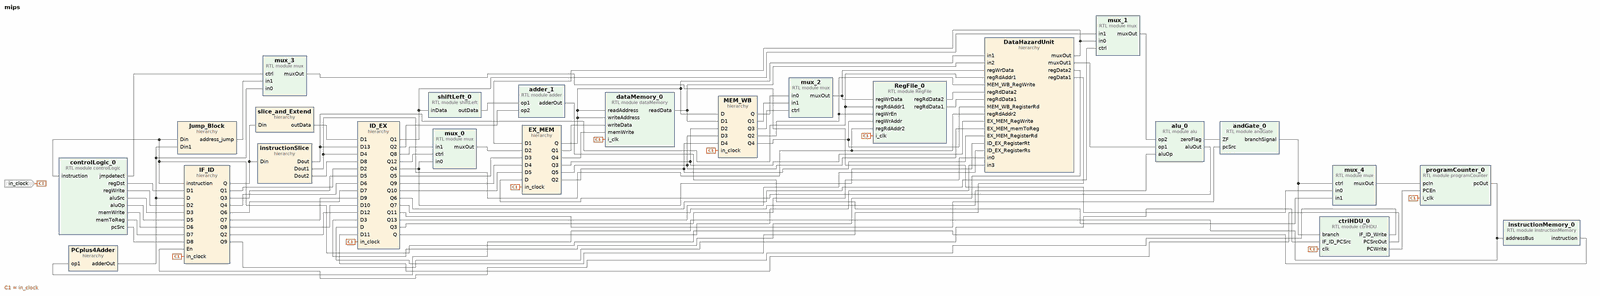
[diagram p0: block diagram of the top level, whole]
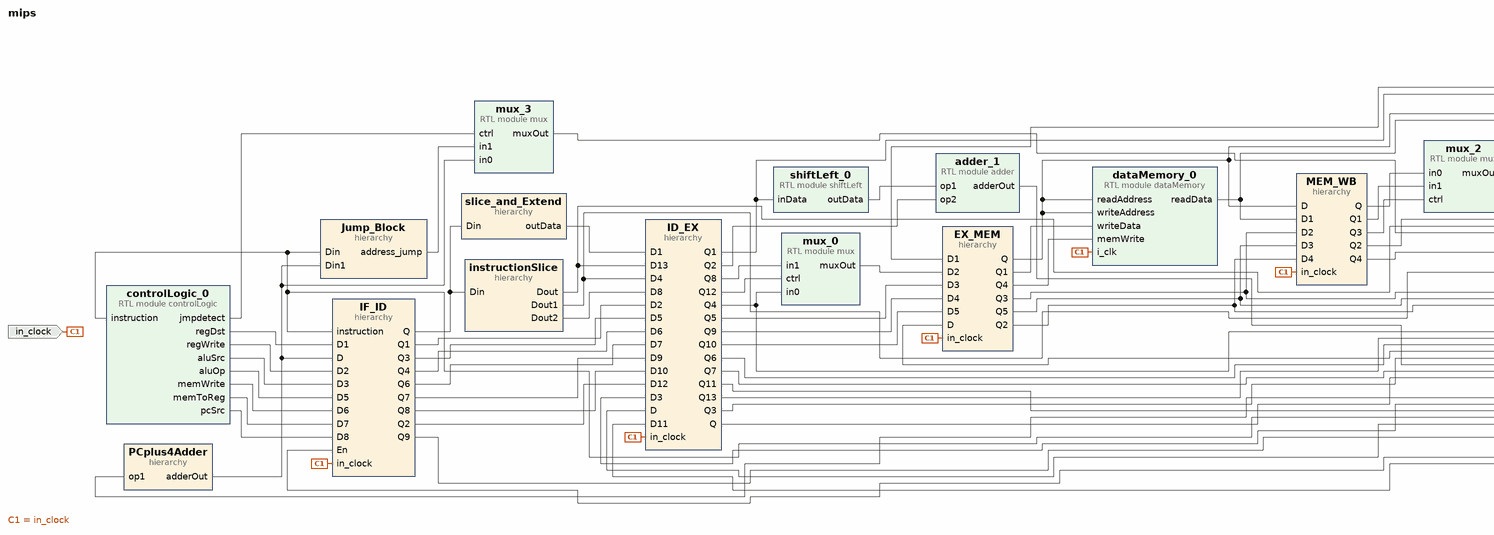
[diagram p1: block diagram of the top level, left part]
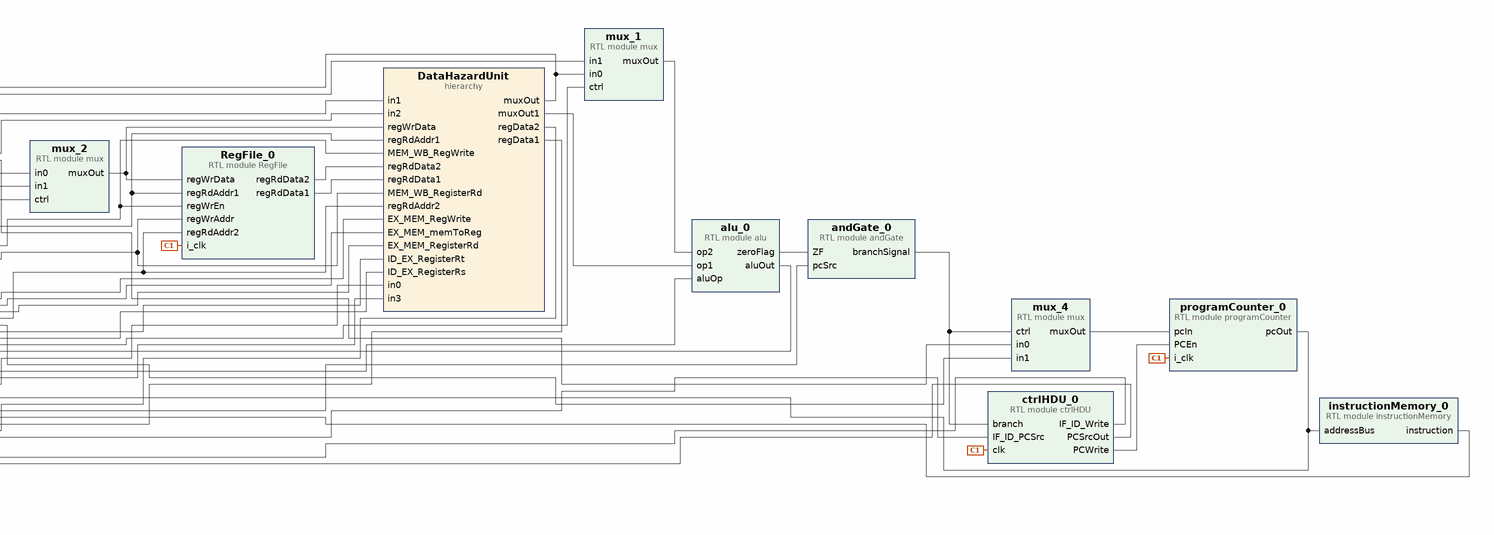
[diagram p2: block diagram of the top level, right part]
# Vivado block design mips, xc7z020clg400-1, Vivado 2020.2
create_bd_design mips

create_bd_port -dir I -type clk in_clock

create_bd_cell -type module -reference mux mux_1
set_property -dict {CONFIG.width 32} [get_bd_cells mux_1]
create_bd_cell -type module -reference mux mux_2
set_property -dict {CONFIG.width 32} [get_bd_cells mux_2]
create_bd_cell -type module -reference shiftLeft shiftLeft_0
create_bd_cell -type module -reference mux mux_3
set_property -dict {CONFIG.width 32} [get_bd_cells mux_3]
create_bd_cell -type module -reference RegFile RegFile_0
create_bd_cell -type module -reference alu alu_0
create_bd_cell -type module -reference mux mux_4
set_property -dict {CONFIG.width 32} [get_bd_cells mux_4]
create_bd_cell -type module -reference mux mux_0
set_property -dict {CONFIG.width 5} [get_bd_cells mux_0]
create_bd_cell -type hier IF_ID
create_bd_cell -type module -reference adder adder_1
set_property -dict {CONFIG.width 32} [get_bd_cells adder_1]
create_bd_cell -type hier ID_EX
create_bd_cell -type hier EX_MEM
create_bd_cell -type hier Jump_Block
create_bd_cell -type hier MEM_WB
create_bd_cell -type hier slice_and_Extend
create_bd_cell -type hier instructionSlice
create_bd_cell -type hier PCplus4Adder
create_bd_cell -type module -reference andGate andGate_0
create_bd_cell -type module -reference programCounter programCounter_0
create_bd_cell -type module -reference dataMemory dataMemory_0
create_bd_cell -type module -reference controlLogic controlLogic_0
create_bd_cell -type hier DataHazardUnit
create_bd_cell -type module -reference ctrlHDU ctrlHDU_0
create_bd_cell -type module -reference instructionMemory instructionMemory_0

# ---- hierarchy /IF_ID ----
current_bd_instance /IF_ID
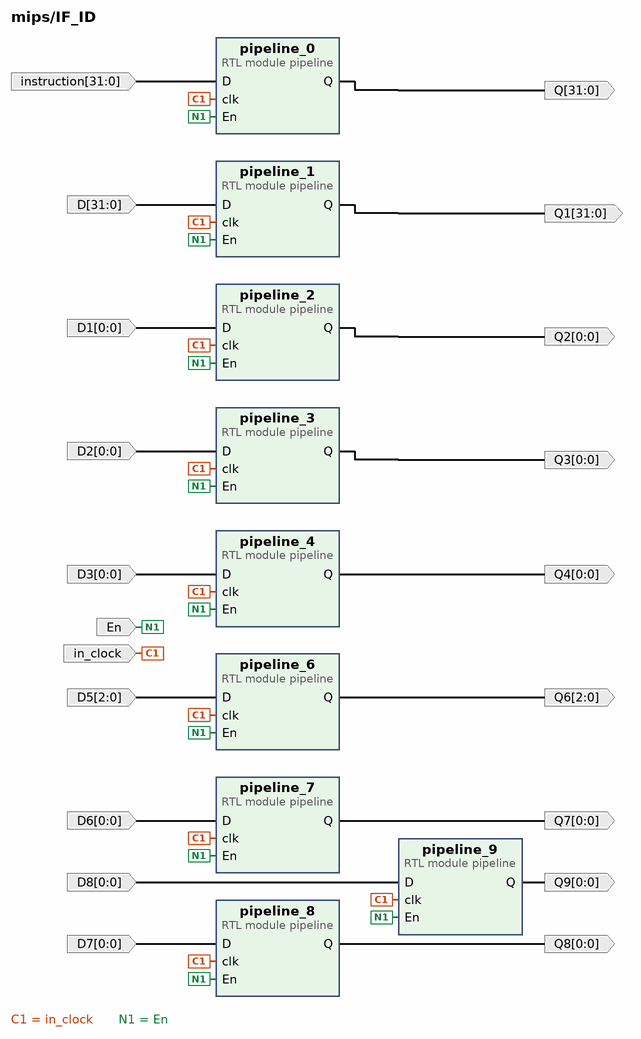
[diagram p3: block diagram inside /IF_ID]
create_bd_pin -dir I -type clk in_clock
create_bd_pin -dir I -from 31 -to 0 instruction
create_bd_pin -dir O -from 31 -to 0 Q
create_bd_pin -dir I -from 31 -to 0 D
create_bd_pin -dir O -from 31 -to 0 Q1
create_bd_pin -dir O -from 0 -to 0 Q2
create_bd_pin -dir I -from 0 -to 0 D1
create_bd_pin -dir O -from 0 -to 0 Q3
create_bd_pin -dir I -from 0 -to 0 D2
create_bd_pin -dir O -from 0 -to 0 Q4
create_bd_pin -dir I -from 0 -to 0 D3
create_bd_pin -dir O -from 2 -to 0 Q6
create_bd_pin -dir I -from 2 -to 0 D5
create_bd_pin -dir I -from 0 -to 0 D6
create_bd_pin -dir O -from 0 -to 0 Q7
create_bd_pin -dir I -from 0 -to 0 D7
create_bd_pin -dir O -from 0 -to 0 Q8
create_bd_pin -dir O -from 0 -to 0 Q9
create_bd_pin -dir I -from 0 -to 0 D8
create_bd_pin -dir I En

create_bd_cell -type module -reference pipeline pipeline_0
create_bd_cell -type module -reference pipeline pipeline_1
create_bd_cell -type module -reference pipeline pipeline_2
set_property -dict {CONFIG.width 1} [get_bd_cells pipeline_2]
create_bd_cell -type module -reference pipeline pipeline_3
set_property -dict {CONFIG.width 1} [get_bd_cells pipeline_3]
create_bd_cell -type module -reference pipeline pipeline_4
set_property -dict {CONFIG.width 1} [get_bd_cells pipeline_4]
create_bd_cell -type module -reference pipeline pipeline_6
set_property -dict {CONFIG.width 3} [get_bd_cells pipeline_6]
create_bd_cell -type module -reference pipeline pipeline_7
set_property -dict {CONFIG.width 1} [get_bd_cells pipeline_7]
create_bd_cell -type module -reference pipeline pipeline_8
set_property -dict {CONFIG.width 1} [get_bd_cells pipeline_8]
create_bd_cell -type module -reference pipeline pipeline_9
set_property -dict {CONFIG.width 1} [get_bd_cells pipeline_9]

# ---- hierarchy /ID_EX ----
current_bd_instance /ID_EX
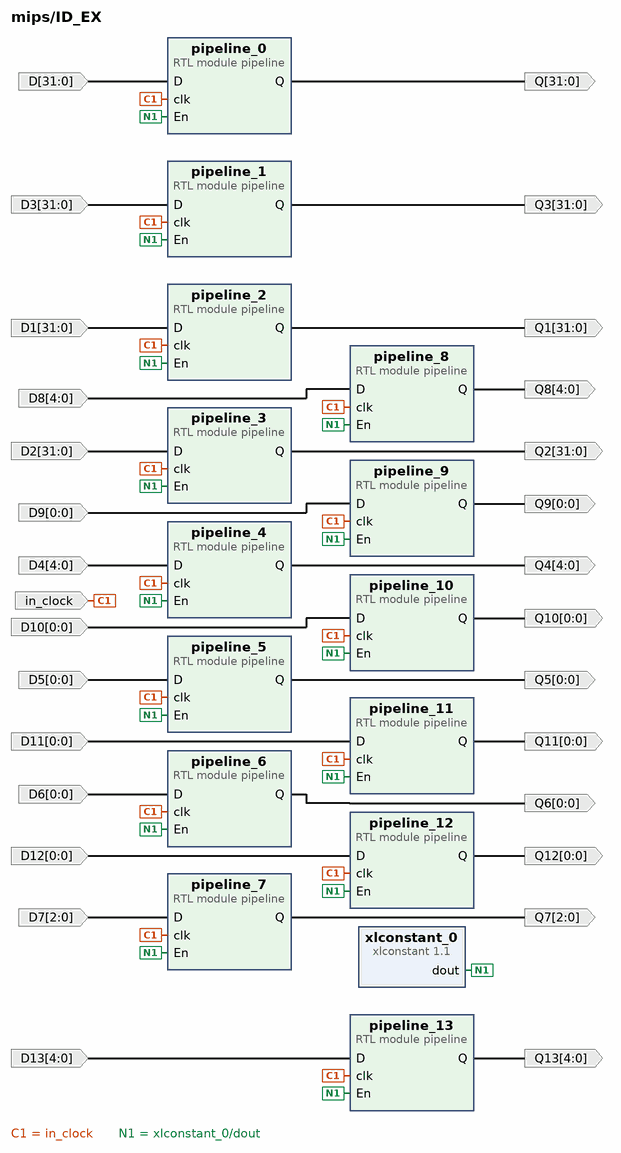
[diagram p4: block diagram inside /ID_EX]
create_bd_pin -dir I -type clk in_clock
create_bd_pin -dir I -from 31 -to 0 D
create_bd_pin -dir O -from 31 -to 0 Q
create_bd_pin -dir I -from 31 -to 0 D1
create_bd_pin -dir O -from 31 -to 0 Q1
create_bd_pin -dir I -from 31 -to 0 D2
create_bd_pin -dir O -from 31 -to 0 Q2
create_bd_pin -dir I -from 31 -to 0 D3
create_bd_pin -dir O -from 31 -to 0 Q3
create_bd_pin -dir I -from 0 -to 0 D5
create_bd_pin -dir O -from 0 -to 0 Q5
create_bd_pin -dir I -from 0 -to 0 D6
create_bd_pin -dir O -from 0 -to 0 Q6
create_bd_pin -dir I -from 2 -to 0 D7
create_bd_pin -dir O -from 2 -to 0 Q7
create_bd_pin -dir I -from 0 -to 0 D9
create_bd_pin -dir O -from 0 -to 0 Q9
create_bd_pin -dir I -from 0 -to 0 D10
create_bd_pin -dir O -from 0 -to 0 Q10
create_bd_pin -dir O -from 0 -to 0 Q11
create_bd_pin -dir I -from 0 -to 0 D11
create_bd_pin -dir I -from 4 -to 0 D4
create_bd_pin -dir I -from 4 -to 0 D8
create_bd_pin -dir I -from 0 -to 0 D12
create_bd_pin -dir O -from 4 -to 0 Q4
create_bd_pin -dir O -from 4 -to 0 Q8
create_bd_pin -dir O -from 0 -to 0 Q12
create_bd_pin -dir I -from 4 -to 0 D13
create_bd_pin -dir O -from 4 -to 0 Q13

create_bd_cell -type module -reference pipeline pipeline_0
create_bd_cell -type module -reference pipeline pipeline_10
set_property -dict {CONFIG.width 1} [get_bd_cells pipeline_10]
create_bd_cell -type module -reference pipeline pipeline_11
set_property -dict {CONFIG.width 1} [get_bd_cells pipeline_11]
create_bd_cell -type module -reference pipeline pipeline_12
set_property -dict {CONFIG.width 1} [get_bd_cells pipeline_12]
create_bd_cell -type module -reference pipeline pipeline_13
set_property -dict {CONFIG.width 5} [get_bd_cells pipeline_13]
create_bd_cell -type module -reference pipeline pipeline_1
create_bd_cell -type module -reference pipeline pipeline_2
create_bd_cell -type module -reference pipeline pipeline_3
create_bd_cell -type module -reference pipeline pipeline_4
set_property -dict {CONFIG.width 5} [get_bd_cells pipeline_4]
create_bd_cell -type module -reference pipeline pipeline_5
set_property -dict {CONFIG.width 1} [get_bd_cells pipeline_5]
create_bd_cell -type module -reference pipeline pipeline_6
set_property -dict {CONFIG.width 1} [get_bd_cells pipeline_6]
create_bd_cell -type module -reference pipeline pipeline_7
set_property -dict {CONFIG.width 3} [get_bd_cells pipeline_7]
create_bd_cell -type module -reference pipeline pipeline_8
set_property -dict {CONFIG.width 5} [get_bd_cells pipeline_8]
create_bd_cell -type module -reference pipeline pipeline_9
set_property -dict {CONFIG.width 1} [get_bd_cells pipeline_9]
create_bd_cell -type ip -vlnv xilinx.com:ip:xlconstant:1.1 xlconstant_0

# ---- hierarchy /EX_MEM ----
current_bd_instance /EX_MEM
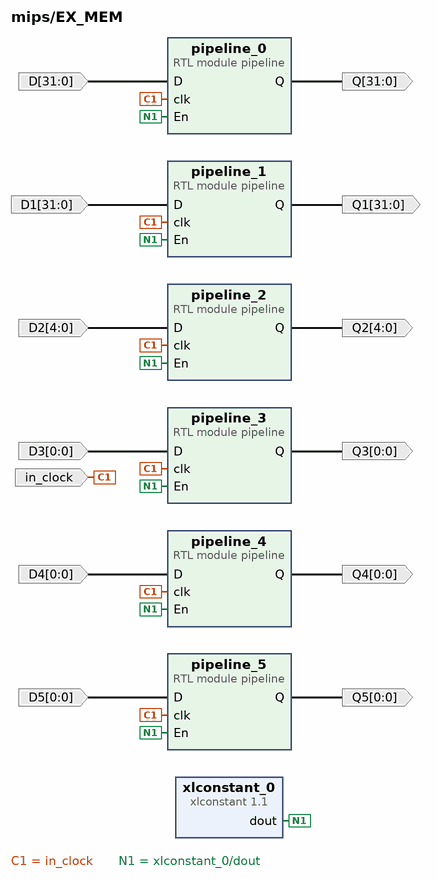
[diagram p5: block diagram inside /EX_MEM]
create_bd_pin -dir I -type clk in_clock
create_bd_pin -dir I -from 31 -to 0 D
create_bd_pin -dir O -from 31 -to 0 Q
create_bd_pin -dir I -from 31 -to 0 D1
create_bd_pin -dir O -from 31 -to 0 Q1
create_bd_pin -dir I -from 0 -to 0 D3
create_bd_pin -dir O -from 0 -to 0 Q3
create_bd_pin -dir I -from 0 -to 0 D4
create_bd_pin -dir O -from 0 -to 0 Q4
create_bd_pin -dir I -from 0 -to 0 D5
create_bd_pin -dir O -from 0 -to 0 Q5
create_bd_pin -dir I -from 4 -to 0 D2
create_bd_pin -dir O -from 4 -to 0 Q2

create_bd_cell -type module -reference pipeline pipeline_0
create_bd_cell -type module -reference pipeline pipeline_1
create_bd_cell -type module -reference pipeline pipeline_2
set_property -dict {CONFIG.width 5} [get_bd_cells pipeline_2]
create_bd_cell -type module -reference pipeline pipeline_3
set_property -dict {CONFIG.width 1} [get_bd_cells pipeline_3]
create_bd_cell -type module -reference pipeline pipeline_4
set_property -dict {CONFIG.width 1} [get_bd_cells pipeline_4]
create_bd_cell -type module -reference pipeline pipeline_5
set_property -dict {CONFIG.width 1} [get_bd_cells pipeline_5]
create_bd_cell -type ip -vlnv xilinx.com:ip:xlconstant:1.1 xlconstant_0

# ---- hierarchy /Jump_Block ----
current_bd_instance /Jump_Block
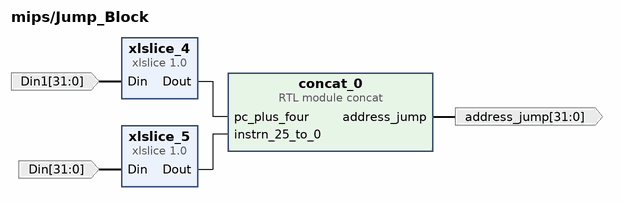
[diagram p6: block diagram inside /Jump_Block]
create_bd_pin -dir O -from 31 -to 0 address_jump
create_bd_pin -dir I -from 31 -to 0 Din
create_bd_pin -dir I -from 31 -to 0 Din1

create_bd_cell -type module -reference concat concat_0
create_bd_cell -type ip -vlnv xilinx.com:ip:xlslice:1.0 xlslice_5
set_property -dict {CONFIG.DIN_FROM 25 CONFIG.DIN_TO 0 CONFIG.DOUT_WIDTH 26} [get_bd_cells xlslice_5]
create_bd_cell -type ip -vlnv xilinx.com:ip:xlslice:1.0 xlslice_4
set_property -dict {CONFIG.DIN_FROM 31 CONFIG.DIN_TO 28 CONFIG.DOUT_WIDTH 4} [get_bd_cells xlslice_4]

# ---- hierarchy /MEM_WB ----
current_bd_instance /MEM_WB
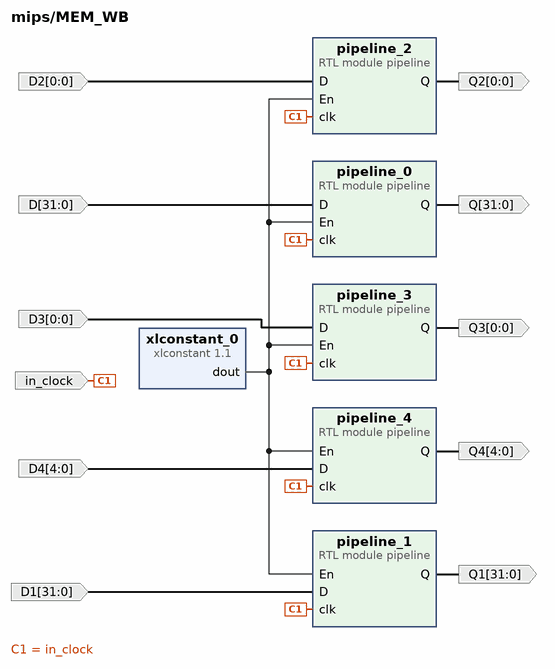
[diagram p7: block diagram inside /MEM_WB]
create_bd_pin -dir I -type clk in_clock
create_bd_pin -dir I -from 31 -to 0 D
create_bd_pin -dir O -from 31 -to 0 Q
create_bd_pin -dir I -from 31 -to 0 D1
create_bd_pin -dir O -from 31 -to 0 Q1
create_bd_pin -dir I -from 0 -to 0 D2
create_bd_pin -dir O -from 0 -to 0 Q2
create_bd_pin -dir I -from 0 -to 0 D3
create_bd_pin -dir O -from 0 -to 0 Q3
create_bd_pin -dir I -from 4 -to 0 D4
create_bd_pin -dir O -from 4 -to 0 Q4

create_bd_cell -type module -reference pipeline pipeline_0
create_bd_cell -type module -reference pipeline pipeline_1
create_bd_cell -type module -reference pipeline pipeline_2
set_property -dict {CONFIG.width 1} [get_bd_cells pipeline_2]
create_bd_cell -type module -reference pipeline pipeline_3
set_property -dict {CONFIG.width 1} [get_bd_cells pipeline_3]
create_bd_cell -type module -reference pipeline pipeline_4
set_property -dict {CONFIG.width 5} [get_bd_cells pipeline_4]
create_bd_cell -type ip -vlnv xilinx.com:ip:xlconstant:1.1 xlconstant_0

# ---- hierarchy /slice_and_Extend ----
current_bd_instance /slice_and_Extend
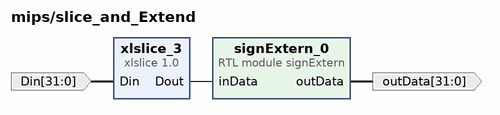
[diagram p8: block diagram inside /slice_and_Extend]
create_bd_pin -dir I -from 31 -to 0 Din
create_bd_pin -dir O -from 31 -to 0 outData

create_bd_cell -type ip -vlnv xilinx.com:ip:xlslice:1.0 xlslice_3
set_property -dict {CONFIG.DIN_FROM 15 CONFIG.DOUT_WIDTH 16} [get_bd_cells xlslice_3]
create_bd_cell -type module -reference signExtern signExtern_0

# ---- hierarchy /instructionSlice ----
current_bd_instance /instructionSlice
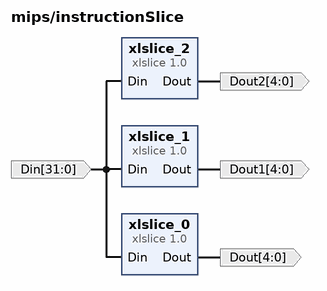
[diagram p9: block diagram inside /instructionSlice]
create_bd_pin -dir I -from 31 -to 0 Din
create_bd_pin -dir O -from 4 -to 0 Dout
create_bd_pin -dir O -from 4 -to 0 Dout1
create_bd_pin -dir O -from 4 -to 0 Dout2

create_bd_cell -type ip -vlnv xilinx.com:ip:xlslice:1.0 xlslice_0
set_property -dict {CONFIG.DIN_FROM 25 CONFIG.DIN_TO 21 CONFIG.DOUT_WIDTH 5} [get_bd_cells xlslice_0]
create_bd_cell -type ip -vlnv xilinx.com:ip:xlslice:1.0 xlslice_1
set_property -dict {CONFIG.DIN_FROM 20 CONFIG.DIN_TO 16 CONFIG.DOUT_WIDTH 5} [get_bd_cells xlslice_1]
create_bd_cell -type ip -vlnv xilinx.com:ip:xlslice:1.0 xlslice_2
set_property -dict {CONFIG.DIN_FROM 15 CONFIG.DIN_TO 11 CONFIG.DOUT_WIDTH 5} [get_bd_cells xlslice_2]

# ---- hierarchy /PCplus4Adder ----
current_bd_instance /PCplus4Adder
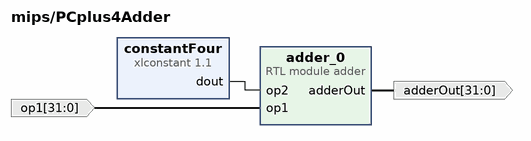
[diagram p10: block diagram inside /PCplus4Adder]
create_bd_pin -dir I -from 31 -to 0 op1
create_bd_pin -dir O -from 31 -to 0 adderOut

create_bd_cell -type module -reference adder adder_0
set_property -dict {CONFIG.width 32} [get_bd_cells adder_0]
create_bd_cell -type ip -vlnv xilinx.com:ip:xlconstant:1.1 constantFour
set_property -dict {CONFIG.CONST_VAL 4 CONFIG.CONST_WIDTH 32} [get_bd_cells constantFour]

# ---- hierarchy /DataHazardUnit ----
current_bd_instance /DataHazardUnit
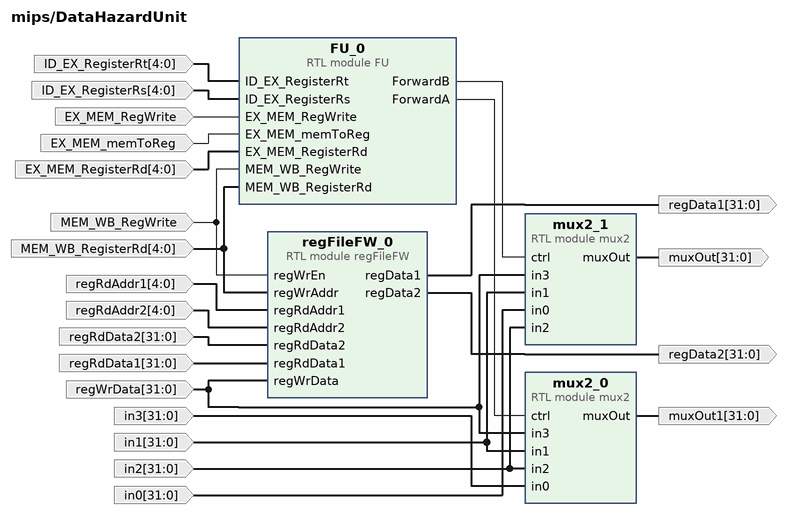
[diagram p11: block diagram inside /DataHazardUnit]
create_bd_pin -dir I -from 4 -to 0 ID_EX_RegisterRt
create_bd_pin -dir I -from 4 -to 0 ID_EX_RegisterRs
create_bd_pin -dir I EX_MEM_RegWrite
create_bd_pin -dir I EX_MEM_memToReg
create_bd_pin -dir I -from 4 -to 0 EX_MEM_RegisterRd
create_bd_pin -dir I MEM_WB_RegWrite
create_bd_pin -dir I -from 4 -to 0 MEM_WB_RegisterRd
create_bd_pin -dir I -from 4 -to 0 regRdAddr1
create_bd_pin -dir I -from 4 -to 0 regRdAddr2
create_bd_pin -dir I -from 31 -to 0 regWrData
create_bd_pin -dir I -from 31 -to 0 regRdData2
create_bd_pin -dir I -from 31 -to 0 regRdData1
create_bd_pin -dir O -from 31 -to 0 regData2
create_bd_pin -dir O -from 31 -to 0 regData1
create_bd_pin -dir O -from 31 -to 0 muxOut
create_bd_pin -dir I -from 31 -to 0 in0
create_bd_pin -dir I -from 31 -to 0 in1
create_bd_pin -dir I -from 31 -to 0 in2
create_bd_pin -dir O -from 31 -to 0 muxOut1
create_bd_pin -dir I -from 31 -to 0 in3

create_bd_cell -type module -reference regFileFW regFileFW_0
create_bd_cell -type module -reference mux2 mux2_1
create_bd_cell -type module -reference mux2 mux2_0
create_bd_cell -type module -reference FU FU_0

# ---- connections ----

current_bd_instance /IF_ID
connect_bd_net -net i_clk_0_1 [get_bd_pins in_clock] \
  [get_bd_pins pipeline_0/clk] [get_bd_pins pipeline_1/clk] [get_bd_pins pipeline_2/clk] [get_bd_pins pipeline_3/clk] \
  [get_bd_pins pipeline_4/clk] [get_bd_pins pipeline_6/clk] [get_bd_pins pipeline_7/clk] [get_bd_pins pipeline_8/clk] \
  [get_bd_pins pipeline_9/clk]
connect_bd_net -net instructionMemory_0_instruction [get_bd_pins instruction] [get_bd_pins pipeline_0/D]
connect_bd_net [get_bd_pins pipeline_0/Q] [get_bd_pins Q]
connect_bd_net -net adder_0_adderOut [get_bd_pins D] [get_bd_pins pipeline_1/D]
connect_bd_net [get_bd_pins pipeline_1/Q] [get_bd_pins Q1]
connect_bd_net [get_bd_pins pipeline_2/Q] [get_bd_pins Q2]
connect_bd_net -net D1_1 [get_bd_pins D1] [get_bd_pins pipeline_2/D]
connect_bd_net [get_bd_pins pipeline_3/Q] [get_bd_pins Q3]
connect_bd_net -net D2_1 [get_bd_pins D2] [get_bd_pins pipeline_3/D]
connect_bd_net [get_bd_pins pipeline_4/Q] [get_bd_pins Q4]
connect_bd_net -net D3_1 [get_bd_pins D3] [get_bd_pins pipeline_4/D]
connect_bd_net [get_bd_pins pipeline_6/Q] [get_bd_pins Q6]
connect_bd_net -net D5_1 [get_bd_pins D5] [get_bd_pins pipeline_6/D]
connect_bd_net -net D6_1 [get_bd_pins D6] [get_bd_pins pipeline_7/D]
connect_bd_net [get_bd_pins pipeline_7/Q] [get_bd_pins Q7]
connect_bd_net -net D7_1 [get_bd_pins D7] [get_bd_pins pipeline_8/D]
connect_bd_net [get_bd_pins pipeline_8/Q] [get_bd_pins Q8]
connect_bd_net [get_bd_pins pipeline_9/Q] [get_bd_pins Q9]
connect_bd_net -net D8_1 [get_bd_pins D8] [get_bd_pins pipeline_9/D]
connect_bd_net [get_bd_pins En] \
  [get_bd_pins pipeline_0/En] [get_bd_pins pipeline_1/En] [get_bd_pins pipeline_2/En] [get_bd_pins pipeline_3/En] \
  [get_bd_pins pipeline_4/En] [get_bd_pins pipeline_6/En] [get_bd_pins pipeline_7/En] [get_bd_pins pipeline_8/En] \
  [get_bd_pins pipeline_9/En]

current_bd_instance /ID_EX
connect_bd_net -net i_clk_0_1 [get_bd_pins in_clock] \
  [get_bd_pins pipeline_0/clk] [get_bd_pins pipeline_10/clk] [get_bd_pins pipeline_11/clk] [get_bd_pins pipeline_12/clk] \
  [get_bd_pins pipeline_13/clk] [get_bd_pins pipeline_1/clk] [get_bd_pins pipeline_2/clk] [get_bd_pins pipeline_3/clk] \
  [get_bd_pins pipeline_4/clk] [get_bd_pins pipeline_5/clk] [get_bd_pins pipeline_6/clk] [get_bd_pins pipeline_7/clk] \
  [get_bd_pins pipeline_8/clk] [get_bd_pins pipeline_9/clk]
connect_bd_net -net RegFile_0_regRdData1 [get_bd_pins D] [get_bd_pins pipeline_0/D]
connect_bd_net [get_bd_pins pipeline_0/Q] [get_bd_pins Q]
connect_bd_net -net signExtern_0_outData [get_bd_pins D1] [get_bd_pins pipeline_2/D]
connect_bd_net [get_bd_pins pipeline_2/Q] [get_bd_pins Q1]
connect_bd_net -net pipeline_1_Q [get_bd_pins D2] [get_bd_pins pipeline_3/D]
connect_bd_net [get_bd_pins pipeline_3/Q] [get_bd_pins Q2]
connect_bd_net -net RegFile_0_regRdData2 [get_bd_pins D3] [get_bd_pins pipeline_1/D]
connect_bd_net [get_bd_pins pipeline_1/Q] [get_bd_pins Q3]
connect_bd_net -net D5_1 [get_bd_pins D5] [get_bd_pins pipeline_5/D]
connect_bd_net [get_bd_pins pipeline_5/Q] [get_bd_pins Q5]
connect_bd_net -net D6_1 [get_bd_pins D6] [get_bd_pins pipeline_6/D]
connect_bd_net [get_bd_pins pipeline_6/Q] [get_bd_pins Q6]
connect_bd_net -net D7_1 [get_bd_pins D7] [get_bd_pins pipeline_7/D]
connect_bd_net [get_bd_pins pipeline_7/Q] [get_bd_pins Q7]
connect_bd_net -net D9_1 [get_bd_pins D9] [get_bd_pins pipeline_9/D]
connect_bd_net [get_bd_pins pipeline_9/Q] [get_bd_pins Q9]
connect_bd_net -net D10_1 [get_bd_pins D10] [get_bd_pins pipeline_10/D]
connect_bd_net [get_bd_pins pipeline_10/Q] [get_bd_pins Q10]
connect_bd_net [get_bd_pins pipeline_11/Q] [get_bd_pins Q11]
connect_bd_net -net D11_1 [get_bd_pins D11] [get_bd_pins pipeline_11/D]
connect_bd_net -net D4_1 [get_bd_pins D4] [get_bd_pins pipeline_4/D]
connect_bd_net -net D8_1 [get_bd_pins D8] [get_bd_pins pipeline_8/D]
connect_bd_net -net D12_1 [get_bd_pins D12] [get_bd_pins pipeline_12/D]
connect_bd_net [get_bd_pins pipeline_4/Q] [get_bd_pins Q4]
connect_bd_net [get_bd_pins pipeline_8/Q] [get_bd_pins Q8]
connect_bd_net [get_bd_pins pipeline_12/Q] [get_bd_pins Q12]
connect_bd_net -net D13_1 [get_bd_pins D13] [get_bd_pins pipeline_13/D]
connect_bd_net [get_bd_pins pipeline_13/Q] [get_bd_pins Q13]
connect_bd_net [get_bd_pins xlconstant_0/dout] \
  [get_bd_pins pipeline_0/En] [get_bd_pins pipeline_2/En] [get_bd_pins pipeline_3/En] [get_bd_pins pipeline_1/En] \
  [get_bd_pins pipeline_5/En] [get_bd_pins pipeline_6/En] [get_bd_pins pipeline_7/En] [get_bd_pins pipeline_9/En] \
  [get_bd_pins pipeline_10/En] [get_bd_pins pipeline_11/En] [get_bd_pins pipeline_4/En] [get_bd_pins pipeline_8/En] \
  [get_bd_pins pipeline_12/En] [get_bd_pins pipeline_13/En]

current_bd_instance /EX_MEM
connect_bd_net -net i_clk_0_1 [get_bd_pins in_clock] \
  [get_bd_pins pipeline_0/clk] [get_bd_pins pipeline_1/clk] [get_bd_pins pipeline_2/clk] [get_bd_pins pipeline_3/clk] \
  [get_bd_pins pipeline_4/clk] [get_bd_pins pipeline_5/clk]
connect_bd_net -net alu_0_zeroFlag [get_bd_pins D] [get_bd_pins pipeline_0/D]
connect_bd_net [get_bd_pins pipeline_0/Q] [get_bd_pins Q]
connect_bd_net -net pipeline_1_Q1 [get_bd_pins D1] [get_bd_pins pipeline_1/D]
connect_bd_net [get_bd_pins pipeline_1/Q] [get_bd_pins Q1]
connect_bd_net -net D3_1 [get_bd_pins D3] [get_bd_pins pipeline_3/D]
connect_bd_net [get_bd_pins pipeline_3/Q] [get_bd_pins Q3]
connect_bd_net -net D4_1 [get_bd_pins D4] [get_bd_pins pipeline_4/D]
connect_bd_net [get_bd_pins pipeline_4/Q] [get_bd_pins Q4]
connect_bd_net -net D5_1 [get_bd_pins D5] [get_bd_pins pipeline_5/D]
connect_bd_net [get_bd_pins pipeline_5/Q] [get_bd_pins Q5]
connect_bd_net -net D2_1 [get_bd_pins D2] [get_bd_pins pipeline_2/D]
connect_bd_net [get_bd_pins pipeline_2/Q] [get_bd_pins Q2]
connect_bd_net [get_bd_pins xlconstant_0/dout] \
  [get_bd_pins pipeline_0/En] [get_bd_pins pipeline_1/En] [get_bd_pins pipeline_3/En] [get_bd_pins pipeline_4/En] \
  [get_bd_pins pipeline_5/En] [get_bd_pins pipeline_2/En]

current_bd_instance /Jump_Block
connect_bd_net [get_bd_pins xlslice_4/Dout] [get_bd_pins concat_0/pc_plus_four]
connect_bd_net [get_bd_pins xlslice_5/Dout] [get_bd_pins concat_0/instrn_25_to_0]
connect_bd_net [get_bd_pins concat_0/address_jump] [get_bd_pins address_jump]
connect_bd_net -net pipeline_0_Q [get_bd_pins Din] [get_bd_pins xlslice_5/Din]
connect_bd_net -net pipeline_1_Q [get_bd_pins Din1] [get_bd_pins xlslice_4/Din]

current_bd_instance /MEM_WB
connect_bd_net -net i_clk_0_1 [get_bd_pins in_clock] \
  [get_bd_pins pipeline_0/clk] [get_bd_pins pipeline_1/clk] [get_bd_pins pipeline_2/clk] [get_bd_pins pipeline_3/clk] \
  [get_bd_pins pipeline_4/clk]
connect_bd_net -net pipeline_0_Q2 [get_bd_pins D] [get_bd_pins pipeline_0/D]
connect_bd_net [get_bd_pins pipeline_0/Q] [get_bd_pins Q]
connect_bd_net -net dataMemory_0_readData [get_bd_pins D1] [get_bd_pins pipeline_1/D]
connect_bd_net [get_bd_pins pipeline_1/Q] [get_bd_pins Q1]
connect_bd_net -net D2_1 [get_bd_pins D2] [get_bd_pins pipeline_2/D]
connect_bd_net [get_bd_pins pipeline_2/Q] [get_bd_pins Q2]
connect_bd_net -net D3_1 [get_bd_pins D3] [get_bd_pins pipeline_3/D]
connect_bd_net [get_bd_pins pipeline_3/Q] [get_bd_pins Q3]
connect_bd_net -net D4_1 [get_bd_pins D4] [get_bd_pins pipeline_4/D]
connect_bd_net [get_bd_pins pipeline_4/Q] [get_bd_pins Q4]
connect_bd_net [get_bd_pins xlconstant_0/dout] \
  [get_bd_pins pipeline_0/En] [get_bd_pins pipeline_1/En] [get_bd_pins pipeline_2/En] [get_bd_pins pipeline_3/En] \
  [get_bd_pins pipeline_4/En]

current_bd_instance /slice_and_Extend
connect_bd_net [get_bd_pins xlslice_3/Dout] [get_bd_pins signExtern_0/inData]
connect_bd_net -net pipeline_0_Q [get_bd_pins Din] [get_bd_pins xlslice_3/Din]
connect_bd_net [get_bd_pins signExtern_0/outData] [get_bd_pins outData]

current_bd_instance /instructionSlice
connect_bd_net -net pipeline_0_Q [get_bd_pins Din] [get_bd_pins xlslice_1/Din] [get_bd_pins xlslice_2/Din] [get_bd_pins xlslice_0/Din]
connect_bd_net [get_bd_pins xlslice_0/Dout] [get_bd_pins Dout]
connect_bd_net [get_bd_pins xlslice_1/Dout] [get_bd_pins Dout1]
connect_bd_net [get_bd_pins xlslice_2/Dout] [get_bd_pins Dout2]

current_bd_instance /PCplus4Adder
connect_bd_net [get_bd_pins constantFour/dout] [get_bd_pins adder_0/op2]
connect_bd_net -net programCounter_0_pcOut [get_bd_pins op1] [get_bd_pins adder_0/op1]
connect_bd_net [get_bd_pins adder_0/adderOut] [get_bd_pins adderOut]

current_bd_instance /DataHazardUnit
connect_bd_net [get_bd_pins ID_EX_RegisterRt] [get_bd_pins FU_0/ID_EX_RegisterRt]
connect_bd_net [get_bd_pins ID_EX_RegisterRs] [get_bd_pins FU_0/ID_EX_RegisterRs]
connect_bd_net [get_bd_pins EX_MEM_RegWrite] [get_bd_pins FU_0/EX_MEM_RegWrite]
connect_bd_net [get_bd_pins EX_MEM_memToReg] [get_bd_pins FU_0/EX_MEM_memToReg]
connect_bd_net [get_bd_pins EX_MEM_RegisterRd] [get_bd_pins FU_0/EX_MEM_RegisterRd]
connect_bd_net [get_bd_pins MEM_WB_RegWrite] [get_bd_pins regFileFW_0/regWrEn] [get_bd_pins FU_0/MEM_WB_RegWrite]
connect_bd_net [get_bd_pins MEM_WB_RegisterRd] [get_bd_pins regFileFW_0/regWrAddr] [get_bd_pins FU_0/MEM_WB_RegisterRd]
connect_bd_net -net regRdAddr1_1 [get_bd_pins regRdAddr1] [get_bd_pins regFileFW_0/regRdAddr1]
connect_bd_net -net regRdAddr2_1 [get_bd_pins regRdAddr2] [get_bd_pins regFileFW_0/regRdAddr2]
connect_bd_net [get_bd_pins regWrData] [get_bd_pins regFileFW_0/regWrData] [get_bd_pins mux2_1/in3] [get_bd_pins mux2_0/in3]
connect_bd_net -net regRdData2_1 [get_bd_pins regRdData2] [get_bd_pins regFileFW_0/regRdData2]
connect_bd_net -net regRdData1_1 [get_bd_pins regRdData1] [get_bd_pins regFileFW_0/regRdData1]
connect_bd_net [get_bd_pins regFileFW_0/regData2] [get_bd_pins regData2]
connect_bd_net [get_bd_pins regFileFW_0/regData1] [get_bd_pins regData1]
connect_bd_net [get_bd_pins FU_0/ForwardB] [get_bd_pins mux2_1/ctrl]
connect_bd_net [get_bd_pins mux2_1/muxOut] [get_bd_pins muxOut]
connect_bd_net -net in0_1 [get_bd_pins in0] [get_bd_pins mux2_1/in0]
connect_bd_net -net in1_1 [get_bd_pins in1] [get_bd_pins mux2_1/in1] [get_bd_pins mux2_0/in1]
connect_bd_net -net in2_1 [get_bd_pins in2] [get_bd_pins mux2_1/in2] [get_bd_pins mux2_0/in2]
connect_bd_net [get_bd_pins FU_0/ForwardA] [get_bd_pins mux2_0/ctrl]
connect_bd_net [get_bd_pins mux2_0/muxOut] [get_bd_pins muxOut1]
connect_bd_net -net in3_1 [get_bd_pins in3] [get_bd_pins mux2_0/in0]

current_bd_instance /
connect_bd_net -net i_clk_0_1 [get_bd_ports in_clock] \
  [get_bd_pins RegFile_0/i_clk] [get_bd_pins ID_EX/in_clock] [get_bd_pins EX_MEM/in_clock] [get_bd_pins MEM_WB/in_clock] \
  [get_bd_pins programCounter_0/i_clk] [get_bd_pins dataMemory_0/i_clk] [get_bd_pins IF_ID/in_clock] \
  [get_bd_pins ctrlHDU_0/clk]
connect_bd_net -net pipeline_1_Q1 [get_bd_pins DataHazardUnit/muxOut] [get_bd_pins mux_1/in0] [get_bd_pins EX_MEM/D1]
connect_bd_net -net pipeline_2_Q [get_bd_pins ID_EX/Q1] [get_bd_pins shiftLeft_0/inData] [get_bd_pins mux_1/in1]
connect_bd_net [get_bd_pins ID_EX/Q6] [get_bd_pins mux_1/ctrl]
connect_bd_net [get_bd_pins mux_1/muxOut] [get_bd_pins alu_0/op2]
connect_bd_net [get_bd_pins programCounter_0/pcOut] [get_bd_pins PCplus4Adder/op1] [get_bd_pins instructionMemory_0/addressBus]
connect_bd_net -net pipeline_0_Q3 [get_bd_pins MEM_WB/Q] [get_bd_pins mux_2/in0]
connect_bd_net -net pipeline_1_Q3 [get_bd_pins MEM_WB/Q1] [get_bd_pins mux_2/in1]
connect_bd_net [get_bd_pins MEM_WB/Q3] [get_bd_pins mux_2/ctrl]
connect_bd_net [get_bd_pins mux_2/muxOut] [get_bd_pins RegFile_0/regWrData] [get_bd_pins DataHazardUnit/regWrData]
connect_bd_net [get_bd_pins shiftLeft_0/outData] [get_bd_pins adder_1/op1]
connect_bd_net -net pipeline_1_Q [get_bd_pins IF_ID/Q1] [get_bd_pins ID_EX/D2]
connect_bd_net [get_bd_pins mux_3/muxOut] [get_bd_pins mux_4/in0]
connect_bd_net -net pipeline_0_Q2 [get_bd_pins EX_MEM/Q] \
  [get_bd_pins MEM_WB/D] [get_bd_pins dataMemory_0/readAddress] [get_bd_pins dataMemory_0/writeAddress] \
  [get_bd_pins DataHazardUnit/in1]
connect_bd_net -net pipeline_1_Q2 [get_bd_pins EX_MEM/Q1] [get_bd_pins dataMemory_0/writeData]
connect_bd_net [get_bd_pins dataMemory_0/readData] [get_bd_pins MEM_WB/D1] [get_bd_pins DataHazardUnit/in2]
connect_bd_net [get_bd_pins EX_MEM/Q4] [get_bd_pins dataMemory_0/memWrite]
connect_bd_net -net xlslice_0_Dout [get_bd_pins instructionSlice/Dout] \
  [get_bd_pins RegFile_0/regRdAddr1] [get_bd_pins ID_EX/D13] [get_bd_pins DataHazardUnit/regRdAddr1]
connect_bd_net -net xlslice_1_Dout [get_bd_pins instructionSlice/Dout1] \
  [get_bd_pins RegFile_0/regRdAddr2] [get_bd_pins ID_EX/D4] [get_bd_pins DataHazardUnit/regRdAddr2]
connect_bd_net [get_bd_pins MEM_WB/Q2] [get_bd_pins RegFile_0/regWrEn] [get_bd_pins DataHazardUnit/MEM_WB_RegWrite]
connect_bd_net [get_bd_pins ID_EX/Q7] [get_bd_pins alu_0/aluOp]
connect_bd_net -net alu_0_zeroFlag [get_bd_pins alu_0/aluOut] [get_bd_pins EX_MEM/D]
connect_bd_net [get_bd_pins instructionMemory_0/instruction] \
  [get_bd_pins IF_ID/instruction] [get_bd_pins controlLogic_0/instruction] [get_bd_pins Jump_Block/Din]
connect_bd_net -net pipeline_0_Q [get_bd_pins IF_ID/Q] [get_bd_pins slice_and_Extend/Din] [get_bd_pins instructionSlice/Din]
connect_bd_net -net adder_0_adderOut [get_bd_pins PCplus4Adder/adderOut] [get_bd_pins IF_ID/D] [get_bd_pins mux_3/in0] [get_bd_pins Jump_Block/Din1]
connect_bd_net -net pipeline_3_Q [get_bd_pins ID_EX/Q2] [get_bd_pins adder_1/op2]
connect_bd_net -net signExtern_0_outData [get_bd_pins slice_and_Extend/outData] [get_bd_pins ID_EX/D1]
connect_bd_net [get_bd_pins ID_EX/Q5] [get_bd_pins EX_MEM/D3]
connect_bd_net [get_bd_pins ID_EX/Q9] [get_bd_pins EX_MEM/D4]
connect_bd_net [get_bd_pins ID_EX/Q10] [get_bd_pins EX_MEM/D5]
connect_bd_net [get_bd_pins EX_MEM/Q3] [get_bd_pins MEM_WB/D2] [get_bd_pins DataHazardUnit/EX_MEM_RegWrite]
connect_bd_net [get_bd_pins EX_MEM/Q5] [get_bd_pins MEM_WB/D3] [get_bd_pins DataHazardUnit/EX_MEM_memToReg]
connect_bd_net [get_bd_pins ID_EX/Q11] [get_bd_pins andGate_0/pcSrc]
connect_bd_net [get_bd_pins andGate_0/branchSignal] [get_bd_pins mux_4/ctrl] [get_bd_pins ctrlHDU_0/branch]
connect_bd_net [get_bd_pins alu_0/zeroFlag] [get_bd_pins andGate_0/ZF]
connect_bd_net [get_bd_pins mux_4/muxOut] [get_bd_pins programCounter_0/pcIn]
connect_bd_net [get_bd_pins controlLogic_0/regDst] [get_bd_pins IF_ID/D1]
connect_bd_net -net D5_1 [get_bd_pins IF_ID/Q3] [get_bd_pins ID_EX/D5]
connect_bd_net [get_bd_pins controlLogic_0/regWrite] [get_bd_pins IF_ID/D2]
connect_bd_net -net D6_1 [get_bd_pins IF_ID/Q4] [get_bd_pins ID_EX/D6]
connect_bd_net [get_bd_pins controlLogic_0/aluSrc] [get_bd_pins IF_ID/D3]
connect_bd_net -net D7_1 [get_bd_pins IF_ID/Q6] [get_bd_pins ID_EX/D7]
connect_bd_net [get_bd_pins controlLogic_0/aluOp] [get_bd_pins IF_ID/D5]
connect_bd_net [get_bd_pins controlLogic_0/memWrite] [get_bd_pins IF_ID/D6]
connect_bd_net -net D9_1 [get_bd_pins IF_ID/Q7] [get_bd_pins ID_EX/D9]
connect_bd_net [get_bd_pins controlLogic_0/memToReg] [get_bd_pins IF_ID/D7]
connect_bd_net -net D10_1 [get_bd_pins IF_ID/Q8] [get_bd_pins ID_EX/D10]
connect_bd_net -net D11_1 [get_bd_pins IF_ID/Q9] [get_bd_pins ctrlHDU_0/IF_ID_PCSrc]
connect_bd_net [get_bd_pins controlLogic_0/pcSrc] [get_bd_pins IF_ID/D8]
connect_bd_net [get_bd_pins instructionSlice/Dout2] [get_bd_pins ID_EX/D8]
connect_bd_net [get_bd_pins IF_ID/Q2] [get_bd_pins ID_EX/D12]
connect_bd_net [get_bd_pins ID_EX/Q4] [get_bd_pins mux_0/in0] [get_bd_pins DataHazardUnit/ID_EX_RegisterRt]
connect_bd_net [get_bd_pins ID_EX/Q8] [get_bd_pins mux_0/in1]
connect_bd_net [get_bd_pins EX_MEM/Q2] [get_bd_pins MEM_WB/D4] [get_bd_pins DataHazardUnit/EX_MEM_RegisterRd]
connect_bd_net [get_bd_pins ID_EX/Q12] [get_bd_pins mux_0/ctrl]
connect_bd_net [get_bd_pins mux_0/muxOut] [get_bd_pins EX_MEM/D2]
connect_bd_net [get_bd_pins MEM_WB/Q4] [get_bd_pins RegFile_0/regWrAddr] [get_bd_pins DataHazardUnit/MEM_WB_RegisterRd]
connect_bd_net [get_bd_pins ID_EX/Q13] [get_bd_pins DataHazardUnit/ID_EX_RegisterRs]
connect_bd_net [get_bd_pins RegFile_0/regRdData2] [get_bd_pins DataHazardUnit/regRdData2]
connect_bd_net [get_bd_pins RegFile_0/regRdData1] [get_bd_pins DataHazardUnit/regRdData1]
connect_bd_net -net D3_1 [get_bd_pins DataHazardUnit/regData2] [get_bd_pins ID_EX/D3]
connect_bd_net -net D_1 [get_bd_pins DataHazardUnit/regData1] [get_bd_pins ID_EX/D]
connect_bd_net [get_bd_pins ID_EX/Q3] [get_bd_pins DataHazardUnit/in0]
connect_bd_net [get_bd_pins DataHazardUnit/muxOut1] [get_bd_pins alu_0/op1]
connect_bd_net [get_bd_pins ID_EX/Q] [get_bd_pins DataHazardUnit/in3]
connect_bd_net [get_bd_pins ctrlHDU_0/PCWrite] [get_bd_pins programCounter_0/PCEn]
connect_bd_net [get_bd_pins ctrlHDU_0/IF_ID_Write] [get_bd_pins IF_ID/En]
connect_bd_net [get_bd_pins ctrlHDU_0/PCSrcOut] [get_bd_pins ID_EX/D11]
connect_bd_net [get_bd_pins controlLogic_0/jmpdetect] [get_bd_pins mux_3/ctrl]
connect_bd_net [get_bd_pins Jump_Block/address_jump] [get_bd_pins mux_3/in1]
connect_bd_net [get_bd_pins adder_1/adderOut] [get_bd_pins mux_4/in1]

validate_bd_design
save_bd_design
